# EAGLE design schematic (EAGLE 9.3.1)
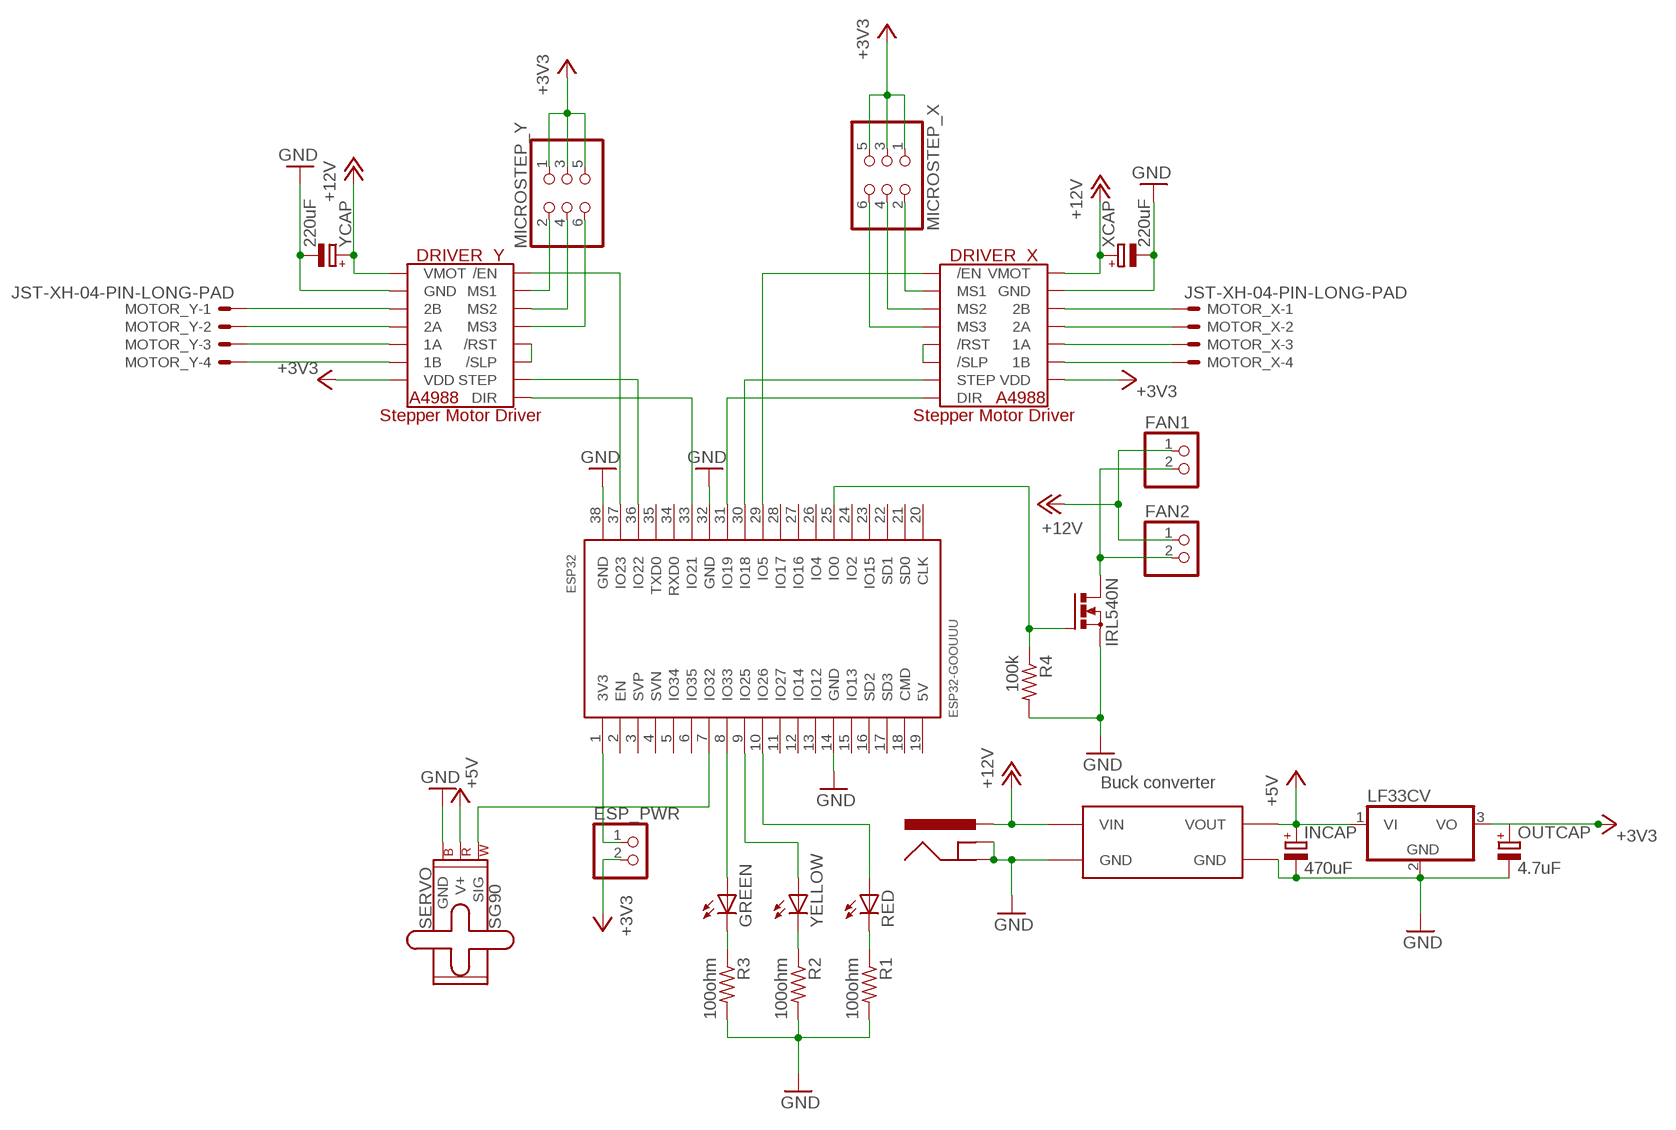
[diagram p0: schematic, sheet 1]

## Parts
DRIVER_X  A4988_STEP  [A4988_STEP]
DRIVER_Y  A4988_STEP  [A4988_STEP]
ESP32  ESP32-GOOUUU  [ESP32--GOOUUU]
ESP_PWR  PINHD-1X2  [1X02]
FAN1  PINHD-1X2  [1X02]
FAN2  PINHD-1X2  [1X02]
GREEN  LED5MM  [LED5MM]
INCAP  470uF  CPOL-EUE2.5-4V  [E2,5RE]
IRL540N  PMOSFET_NTO220BV  [TO220BV]
LF33CV  LF33CVTV  [TO220V]
MICROSTEP_X  PINHD-2X3  [2X03]
MICROSTEP_Y  PINHD-2X3  [2X03]
MOTOR_X  JST-XH-04-PIN-LONG-PAD  [JST-XH-04-PACKAGE-LONG-PAD]
MOTOR_Y  JST-XH-04-PIN-LONG-PAD  [JST-XH-04-PACKAGE-LONG-PAD]
OUTCAP  4.7uF  CPOL-EUE2.5-4V  [E2,5RE]
POWER_JACK  POWER_JACKPTH  [POWER_JACK_PTH]
R1  100ohm  R-US_0207/10  [0207/10]
R2  100ohm  R-US_0207/10  [0207/10]
R3  100ohm  R-US_0207/10  [0207/10]
R4  100k  R-US_0207/10  [0207/10]
RED  LED5MM  [LED5MM]
SG90  SERVO  [1X03]
U$2  BUCK-CONVERTER  [BUCK-CONVERTER]
XCAP  220uF  CPOL-EUE2.5-6  [E2,5-6]
YCAP  220uF  CPOL-EUE2.5-6  [E2,5-6]
YELLOW  LED5MM  [LED5MM]

## Nets
1AX: DRIVER_X.1A MOTOR_X.3
1AY: DRIVER_Y.1A MOTOR_Y.3
1BX: DRIVER_X.1B MOTOR_X.4
1BY: DRIVER_Y.1B MOTOR_Y.4
2AX: DRIVER_X.2A MOTOR_X.2
2AY: DRIVER_Y.2A MOTOR_Y.2
2BX: DRIVER_X.2B MOTOR_X.1
2BY: DRIVER_Y.2B MOTOR_Y.1
+3V3: DRIVER_X.VDD DRIVER_Y.VDD ESP_PWR.2 LF33CV.3(VO) MICROSTEP_X.1 MICROSTEP_X.3 MICROSTEP_X.5 MICROSTEP_Y.1 MICROSTEP_Y.3 MICROSTEP_Y.5 OUTCAP.+
+5V: INCAP.+ LF33CV.1(VI) SG90.2(V+) U$2.VOUT1(VOUT) U$2.VOUT2(VOUT)
+12V: DRIVER_X.VMOT DRIVER_Y.VMOT FAN1.1 FAN2.1 POWER_JACK.PWR U$2.VIN1(VIN) U$2.VIN2(VIN) XCAP.+ YCAP.+
ESP_PWR: ESP32.1(3V3) ESP_PWR.1
FAN_EN: ESP32.25(IO0) IRL540N.G R4.1
FAN_PW: FAN1.2 FAN2.2 IRL540N.D
GND: DRIVER_X.GND DRIVER_X.GND2(GND) DRIVER_Y.GND DRIVER_Y.GND2(GND) ESP32.14(GND) ESP32.32(GND) ESP32.38(GND) INCAP.- IRL540N.S LF33CV.2(GND) OUTCAP.- POWER_JACK.GND POWER_JACK.GND@1(GND) R1.2 R2.2 R3.2 R4.2 SG90.3(GND) U$2.GND@1(GND) U$2.GND@2(GND) U$2.GND@3(GND) U$2.GND@4(GND) XCAP.- YCAP.-
GREEN_LED: ESP32.8(IO33) GREEN.A
GREEN_R3: GREEN.K(C) R3.1
N$5: DRIVER_Y.MS1 MICROSTEP_Y.2
N$6: DRIVER_Y./RST DRIVER_Y./SLP
N$9: DRIVER_Y.MS2 MICROSTEP_Y.4
N$10: DRIVER_Y.MS3 MICROSTEP_Y.6
N$11: DRIVER_X.MS1 MICROSTEP_X.2
N$12: DRIVER_X.MS2 MICROSTEP_X.4
N$13: DRIVER_X.MS3 MICROSTEP_X.6
N$18: DRIVER_X./RST DRIVER_X./SLP
RED_LED: ESP32.10(IO26) RED.A
RED_R1: R1.1 RED.K(C)
SERVO: ESP32.7(IO32) SG90.1(SIG)
X_DIR: DRIVER_X.DIR ESP32.31(IO19)
X_EN: DRIVER_X./EN ESP32.29(IO5)
X_STEP: DRIVER_X.STEP ESP32.30(IO18)
Y_DIR: DRIVER_Y.DIR ESP32.33(IO21)
Y_EN: DRIVER_Y./EN ESP32.37(IO23)
Y_STEP: DRIVER_Y.STEP ESP32.36(IO22)
YELLOW_LED: ESP32.9(IO25) YELLOW.A
YELLOW_R2: R2.1 YELLOW.K(C)
Unconnected: ESP32.2(EN) ESP32.3(SVP) ESP32.4(SVN) ESP32.5(IO34) ESP32.6(IO35) ESP32.11(IO27) ESP32.12(IO14) ESP32.13(IO12) ESP32.15(IO13) ESP32.16(SD2) ESP32.17(SD3) ESP32.18(CMD) ESP32.19(5V) ESP32.20(CLK) ESP32.21(SD0) ESP32.22(SD1) ESP32.23(IO15) ESP32.24(IO2) ESP32.26(IO4) ESP32.27(IO16) ESP32.28(IO17) ESP32.34(RXD0) ESP32.35(TXD0)

## Library data of the parts
DRIVER_X DRIVER_Y = IC_mine:A4988_STEP
ESP32 = ESP32-GOOUUU:ESP32-GOOUUU
ESP_PWR FAN1 FAN2 = pinhead:PINHD-1X2: PIN HEADER
GREEN RED YELLOW = SparkFun-3-2-07:LED: LEDs Standard schematic elements and footprints for 5mm, 3mm, 1206, and 0603 sized LEDs. 5mm - Spark Fun Electronics SKU : Comp-SBL
INCAP OUTCAP XCAP YCAP = rcl:CPOL-EU: POLARIZED CAPACITOR, European symbol; SPICEPREFIX: C
IRL540N = transistor-power:PMOSFET_N: Power MOSFET N-Channel
LF33CV = linear_my:LF33CV: Positive VOLTAGE REGULATOR Source: http://cache.national.com/ds/LM/LM78L05.pdf http://www.fairchildsemi.com/ds/LM/LM7805.pdf
MICROSTEP_X MICROSTEP_Y = pinhead:PINHD-2X3: PIN HEADER
MOTOR_X MOTOR_Y = Rembrandt Electronics - JST XH Connectors v1-0:JST-XH-04-PIN: JST XH Connector 2 Pin Wire to board connector. Pitch: 2,54 mm, (0.100") Number of pins: 4 Created by Rembrandt Electronics www.rembrandtelectronics.com
POWER_JACK = SparkFun-3-2-07:POWER_JACK: Power Jack This is the standard 5.5mm barrel jack for power. The PTH is the most common, proven, reliable, footprint. All others are experimental. The Slot footprint only works if the mill layer is transmitted to the PCB fab house so be warned. Spark Fun Electronics SKU : PType-BPJ. Mating wall wart : Tools-PS
R1-R4 = rcl:R-US_: RESISTOR, American symbol; SPICEPREFIX: R
SG90 = SparkFun-Electromechanical:SERVO: Servo Motor 3-pin connector for a standard servo motor (voltage supply, ground, and control signal.) SparkFun Products Servo - Generic (Sub-Micro Size) <https://www.sparkfun.com/products/9065> (ROB-09065) Servo - Generic High Torque Continuous Rotation (Standard Size) <https://www.sparkfun.com/products/9347> (ROB-09347) Servo - Generic High Torque (Standard Size) <https://www.sparkfun.com/products/11965> (ROB-11965)
U$2 = mine:BUCK-CONVERTER

## Board
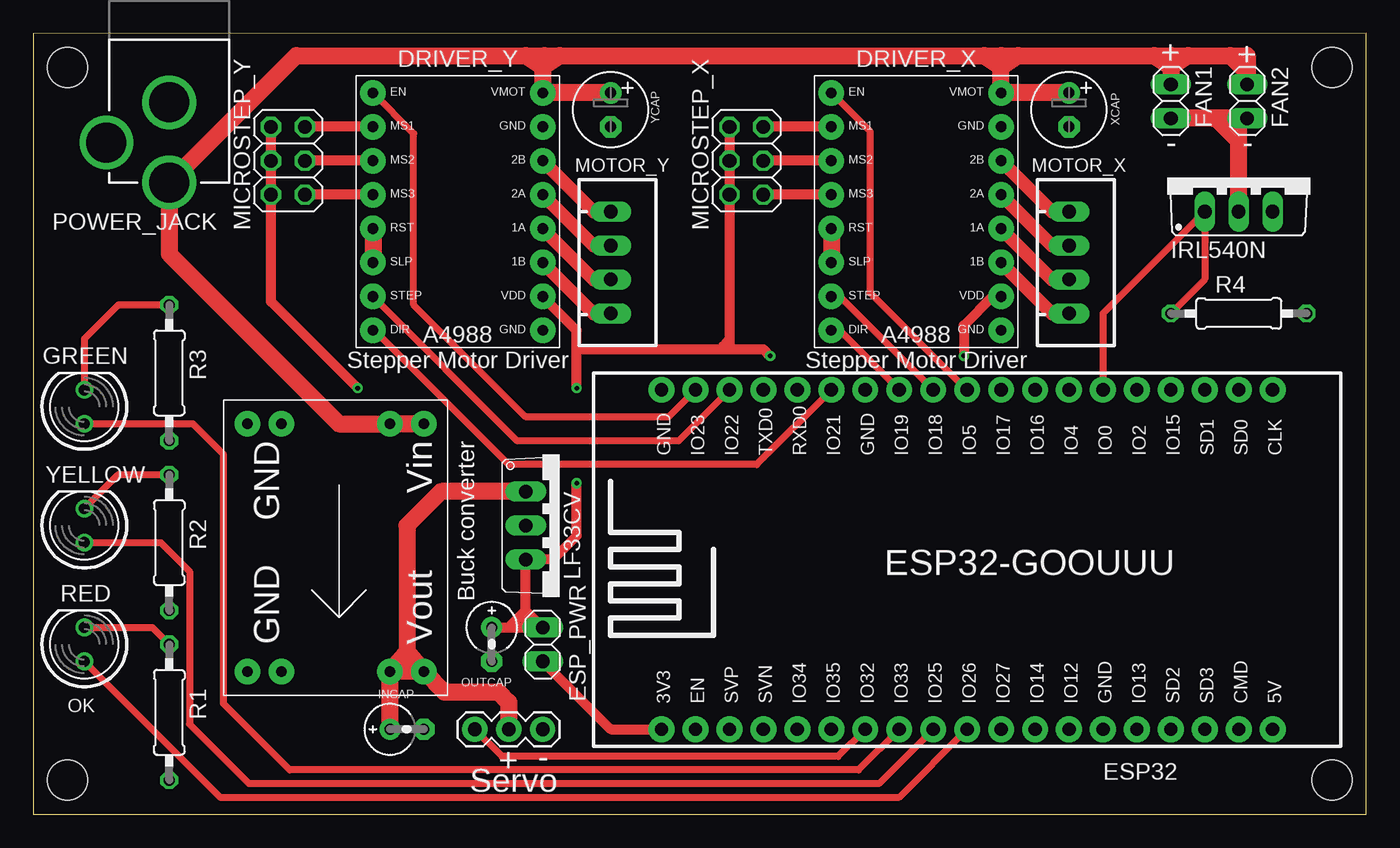
[diagram p1: board, top side]
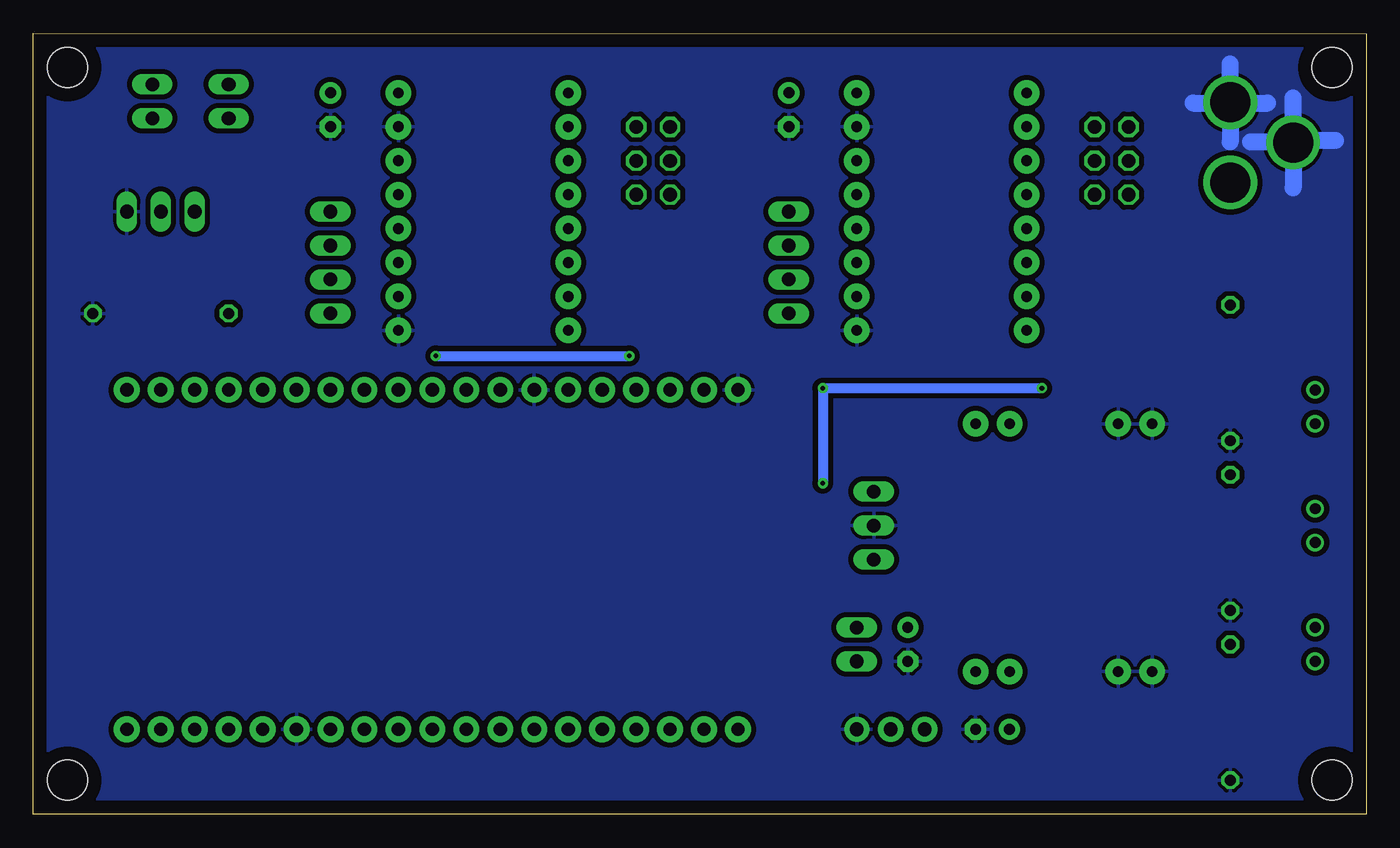
[diagram p2: board, bottom side, seen from below]

Size 99.69 x 58.42 mm. Coordinates in mm from the lower left corner, seen from the top.
Outline: 0,0 99.69,0 99.69,58.42 0,58.41 0,0
Copper layers (1*16): Top 0.035mm / dielectric 1.5mm / Bottom 0.035mm
Design rules "default": minimum track width 6mil, minimum drill 0.35mm, track to track 6mil, track to pad 6mil, pad to pad 6mil, via to via 6mil, smd to smd 6mil, copper to edge 40mil, drill to drill 6mil, minimum pad ring 10mil, minimum via ring 8mil, stop-mask expansion 4mil, vias tented up to drill 0mil, thermal gap 10mil
Holes 3 mm at 2.54,55.88 2.54,2.54 97.16,55.88 97.16,2.54

### Footprints (pad centres in the part's own frame; a part is rotated, then mirrored left to right if it is on the bottom)
A4988_STEP = drill 0.8 pad 1.905: 1A 6.35,-1.27; 1B 6.35,-3.81; 2A 6.35,1.27; 2B 6.35,3.81; /EN -6.35,8.89; /RST -6.35,-1.27; /SLP -6.35,-3.81; DIR -6.35,-8.89; GND 6.35,6.35; GND2 6.35,-8.89; MS1 -6.35,6.35; MS2 -6.35,3.81; MS3 -6.35,1.27; STEP -6.35,-6.35; VDD 6.35,-6.35; VMOT 6.35,8.89
ESP32--GOOUUU = drill 1 pad 1.93: 1 -22.86,-11.43; 2 -20.32,-11.43; 3 -17.78,-11.43; 4 -15.24,-11.43; 5 -12.7,-11.43; 6 -10.16,-11.43; 7 -7.62,-11.43; 8 -5.08,-11.43; 9 -2.54,-11.43; 10 0,-11.43; 11 2.54,-11.43; 12 5.08,-11.43; 13 7.62,-11.43; 14 10.16,-11.43; 15 12.7,-11.43; 16 15.24,-11.43; 17 17.78,-11.43; 18 20.32,-11.43; 19 22.86,-11.43; 20 22.86,13.97; 21 20.32,13.97; 22 17.78,13.97; 23 15.24,13.97; 24 12.7,13.97; 25 10.16,13.97; 26 7.62,13.97; 27 5.08,13.97; 28 2.54,13.97; 29 0,13.97; 30 -2.54,13.97; 31 -5.08,13.97; 32 -7.62,13.97; 33 -10.16,13.97; 34 -12.7,13.97; 35 -15.24,13.97; 36 -17.78,13.97; 37 -20.32,13.97; 38 -22.86,13.97
1X02 = drill 1.016 long: 1 -1.27,0; 2 1.27,0
LED5MM = drill 0.813: A -1.27,0; K 1.27,0
E2,5RE = drill 0.813 pad 1.575: + -1.27,0 | drill 0.813 pad 1.575 octagon: - 1.27,0
TO220BV = drill 1.016 long: D 0,-2.54; G -2.54,-2.54; S 2.54,-2.54
TO220V = drill 1.016 long: 1 -2.54,-2.54; 2 0,-2.54; 3 2.54,-2.54
2X03 = drill 1.016 octagon: 1 -2.54,-1.27; 2 -2.54,1.27; 3 0,-1.27; 4 0,1.27; 5 2.54,-1.27; 6 2.54,1.27
JST-XH-04-PACKAGE-LONG-PAD = drill 1.016 long: 1 -3.81,0; 2 -1.27,0; 3 1.27,0; 4 3.81,0
POWER_JACK_PTH = drill 2.997: GND 0,7.7; GND@1 4.7,10.7; PWR 0,13.7
0207/10 = drill 0.813 octagon: 1 -5.08,0; 2 5.08,0
1X03 = drill 1.016 pad 1.88: 1 0,0; 2 2.54,0; 3 5.08,0
BUCK-CONVERTER = drill 0.787 pad 1.905: GND@1 -3.81,-11.938; GND@2 -3.81,-14.478; GND@3 14.732,-11.938; GND@4 14.732,-14.478; VIN1 -3.81,-1.27; VIN2 -3.81,-3.81; VOUT1 14.732,-1.27; VOUT2 14.732,-3.81
E2,5-6 = drill 0.813 pad 1.6: + -1.27,0 | drill 0.813 pad 1.6 octagon: - 1.27,0

### Placement (x,y rotation side)
DRIVER_X  66.04,45.09 0 top
DRIVER_Y  31.75,45.09 0 top
ESP32  69.85,17.78 0 top
ESP_PWR  38.1,12.7 90 top
FAN1  85.09,53.34 270 top
FAN2  90.81,53.34 270 top
GREEN  3.81,30.48 90 top
INCAP  27.94,6.35 0 top
IRL540N  90.17,47.62 0 top
LF33CV  39.37,21.59 270 top
MICROSTEP_X  53.34,48.9 270 top
MICROSTEP_Y  19.05,48.9 270 top
MOTOR_X  77.47,41.27 270 top
MOTOR_Y  43.18,41.27 270 top
OUTCAP  34.29,12.7 270 top
POWER_JACK  10.16,60.96 180 top
R1  10.16,7.62 270 top
R2  10.16,20.32 270 top
R3  10.16,33.02 270 top
R4  90.17,37.47 0 top
RED  3.81,12.7 90 top
SG90  33.02,6.35 0 top
U$2  30.48,25.4 270 top
XCAP  77.47,52.7 270 top
YCAP  43.18,52.7 270 top
YELLOW  3.81,21.59 90 top

### Tracks (layer width: path | path; a pad name or v marks a point on that pad's centre or on a via)
1AX
  Top 1.016: DRIVER_X.1A 76.2,40.01 MOTOR_X.3
1AY
  Top 1.016: DRIVER_Y.1A 41.91,40.01 MOTOR_Y.3
1BX
  Top 1.016: DRIVER_X.1B 76.2,37.47 MOTOR_X.4
1BY
  Top 1.016: DRIVER_Y.1B 41.91,37.47 MOTOR_Y.4
2AX
  Top 1.016: DRIVER_X.2A 76.2,42.55 MOTOR_X.2
2AY
  Top 1.016: DRIVER_Y.2A 41.91,42.55 MOTOR_Y.2
2BX
  Top 1.016: DRIVER_X.2B 76.2,45.09 MOTOR_X.1
2BY
  Top 1.016: DRIVER_Y.2B 41.91,45.09 MOTOR_Y.1
+3V3  (via drill 0.35)
  Top 0.762: MICROSTEP_X.1 MICROSTEP_X.3 MICROSTEP_X.5 52.07,35.56 | 40.64,34.8 51.44,34.8 | 51.44,34.8 52.07,34.8 | 52.07,35.56 52.07,34.8 | DRIVER_X.VDD 71.75,38.73 69.6,36.58 v69.6,34.29 | v24.26,31.88 17.78,38.35 MICROSTEP_Y.5 MICROSTEP_Y.3 MICROSTEP_Y.1 | v40.64,24.77 40.64,20.83 38.86,19.05 LF33CV.3 36.83,15.24 | 40.64,34.8 40.64,36.2 DRIVER_Y.VDD | 52.07,35.56 51.64,35.05 51.44,34.8 | v40.64,31.88 40.64,34.8 | 52.07,34.8 54.61,34.8 v55.12,34.29 | 36.83,15.24 ESP_PWR.2 36.96,13.97 | OUTCAP.+ 35.56,13.97 | 35.56,13.97 36.96,13.97 | 36.83,15.24 36.83,14.1 36.96,13.97 | 36.83,15.24 35.56,13.97
  Bottom 0.762: v69.6,34.29 v55.12,34.29 | v40.64,24.77 v40.64,31.88 v24.26,31.88
+5V
  Top 1.27: INCAP.+ U$2.VOUT2 | 27.94,12.19 27.94,21.59 30.48,24.13 LF33CV.1 | SG90.2 35.56,8.38 34.8,9.14 30.73,9.14 U$2.VOUT1 | U$2.VOUT1 U$2.VOUT2 | U$2.VOUT1 27.94,12.19 | 27.94,12.19 U$2.VOUT2
+12V
  Top 1.27: 36.83,56.76 19.66,56.76 POWER_JACK.PWR 10.16,41.91 22.86,29.21 U$2.VIN2 U$2.VIN1 | 36.83,56.76 38.23,56.76 | 38.23,56.76 39.37,56.76 | 39.37,56.76 71.12,56.76 | 71.12,56.76 72.39,56.76 | 72.39,55.88 DRIVER_X.VMOT XCAP.+ | 72.39,55.88 72.39,56.76 | 72.39,56.76 73.66,56.76 | 73.66,56.76 83.82,56.76 | 83.82,56.76 85.09,56.76 | 85.09,56.76 86.36,56.76 | 86.36,56.76 89.53,56.76 | 85.09,56.76 85.09,55.88 | 85.09,55.88 FAN1.1 | 38.23,56.76 38.1,56.63 38.1,55.88 | 38.1,55.88 DRIVER_Y.VMOT YCAP.+ | 89.53,56.76 90.81,55.49 FAN2.1 90.81,56.76 89.53,56.76 | 86.36,56.76 85.09,55.88 | 85.09,55.88 83.82,56.76 | 72.39,55.88 73.66,56.76 | 72.39,55.88 71.12,56.76 | 38.1,55.88 39.37,56.76 | 38.1,55.88 36.83,56.76
ESP_PWR
  Top 0.762: ESP_PWR.1 43.18,6.35 ESP32.1
FAN_EN
  Top 0.508: ESP32.25 80.01,37.47 IRL540N.G 87.63,40.01 R4.1
FAN_PW
  Top 1.016: 88.27,52.07 90.17,50.16
  Top 1.27: 90.17,52.07 88.27,52.07 FAN1.2 | IRL540N.D 90.17,50.16 90.17,52.07 | 90.17,52.07 FAN2.2
GND
  Bottom 1.27: POWER_JACK.GND 10.16,56.13 | POWER_JACK.GND 10.16,50.29 | 12.95,53.21 10.21,53.21 | 10.21,53.21 POWER_JACK.GND | 10.21,53.21 7.37,53.21 | POWER_JACK.GND@1 5.46,53.59 | POWER_JACK.GND@1 5.49,50.29 8.64,50.29 | POWER_JACK.GND@1 5.46,46.86 | POWER_JACK.GND@1 5.3,50.42 2.29,50.42
  pour Bottom (isolate 0.381): -5.08,64.77 -5.08,-6.35 105.41,-6.35 105.41,64.77
GREEN_LED
  Top 0.508: ESP32.8 61.72,3.3 19.18,3.3 14.22,8.26 14.22,26.92 11.94,29.21 GREEN.A
GREEN_R3
  Top 0.508: R3.1 6.35,38.1 3.81,35.56 GREEN.K
N$5
  Top 0.762: DRIVER_Y.MS1 MICROSTEP_Y.2
N$6
  Top 1.27: DRIVER_Y./RST DRIVER_Y./SLP
N$9
  Top 0.762: DRIVER_Y.MS2 MICROSTEP_Y.4
N$10
  Top 0.762: DRIVER_Y.MS3 MICROSTEP_Y.6
N$11
  Top 0.762: DRIVER_X.MS1 MICROSTEP_X.2
N$12
  Top 0.762: DRIVER_X.MS2 MICROSTEP_X.4
N$13
  Top 0.762: DRIVER_X.MS3 MICROSTEP_X.6
N$18
  Top 1.27: DRIVER_X./RST DRIVER_X./SLP
RED_LED
  Top 0.508: ESP32.10 64.77,1.27 13.97,1.27 RED.A
RED_R1
  Top 0.508: RED.K 8.89,13.97 R1.1
SERVO
  Top 0.508: SG90.1 35.05,4.32 60.2,4.32 ESP32.7
X_DIR
  Top 0.508: ESP32.31 60.33,36.2 DRIVER_X.DIR
X_EN
  Top 0.508: ESP32.29 62.61,38.99 62.61,51.05 DRIVER_X./EN
X_STEP
  Top 0.508: ESP32.30 60.33,38.73 DRIVER_X.STEP
Y_DIR
  Top 0.508: ESP32.33 54.1,26.16 35.56,26.16 25.53,36.2 DRIVER_Y.DIR
Y_EN
  Top 0.508: ESP32.37 47.5,29.72 36.83,29.72 28.45,38.1 28.45,50.93 DRIVER_Y./EN
Y_STEP
  Top 0.508: ESP32.36 48.26,27.94 36.2,27.94 DRIVER_Y.STEP
YELLOW_LED
  Top 0.508: YELLOW.A 9.53,20.32 11.68,18.16 11.68,6.73 16.13,2.29 57.02,2.29 58.17,2.29 63.25,2.29 ESP32.9
YELLOW_R2
  Top 0.508: YELLOW.K 6.35,25.4 R2.1

### Text on the board
tNames: + | + | - | - | OK | + | - | Servo